# EAGLE schematic schema no connections (EAGLE 7.2.0)
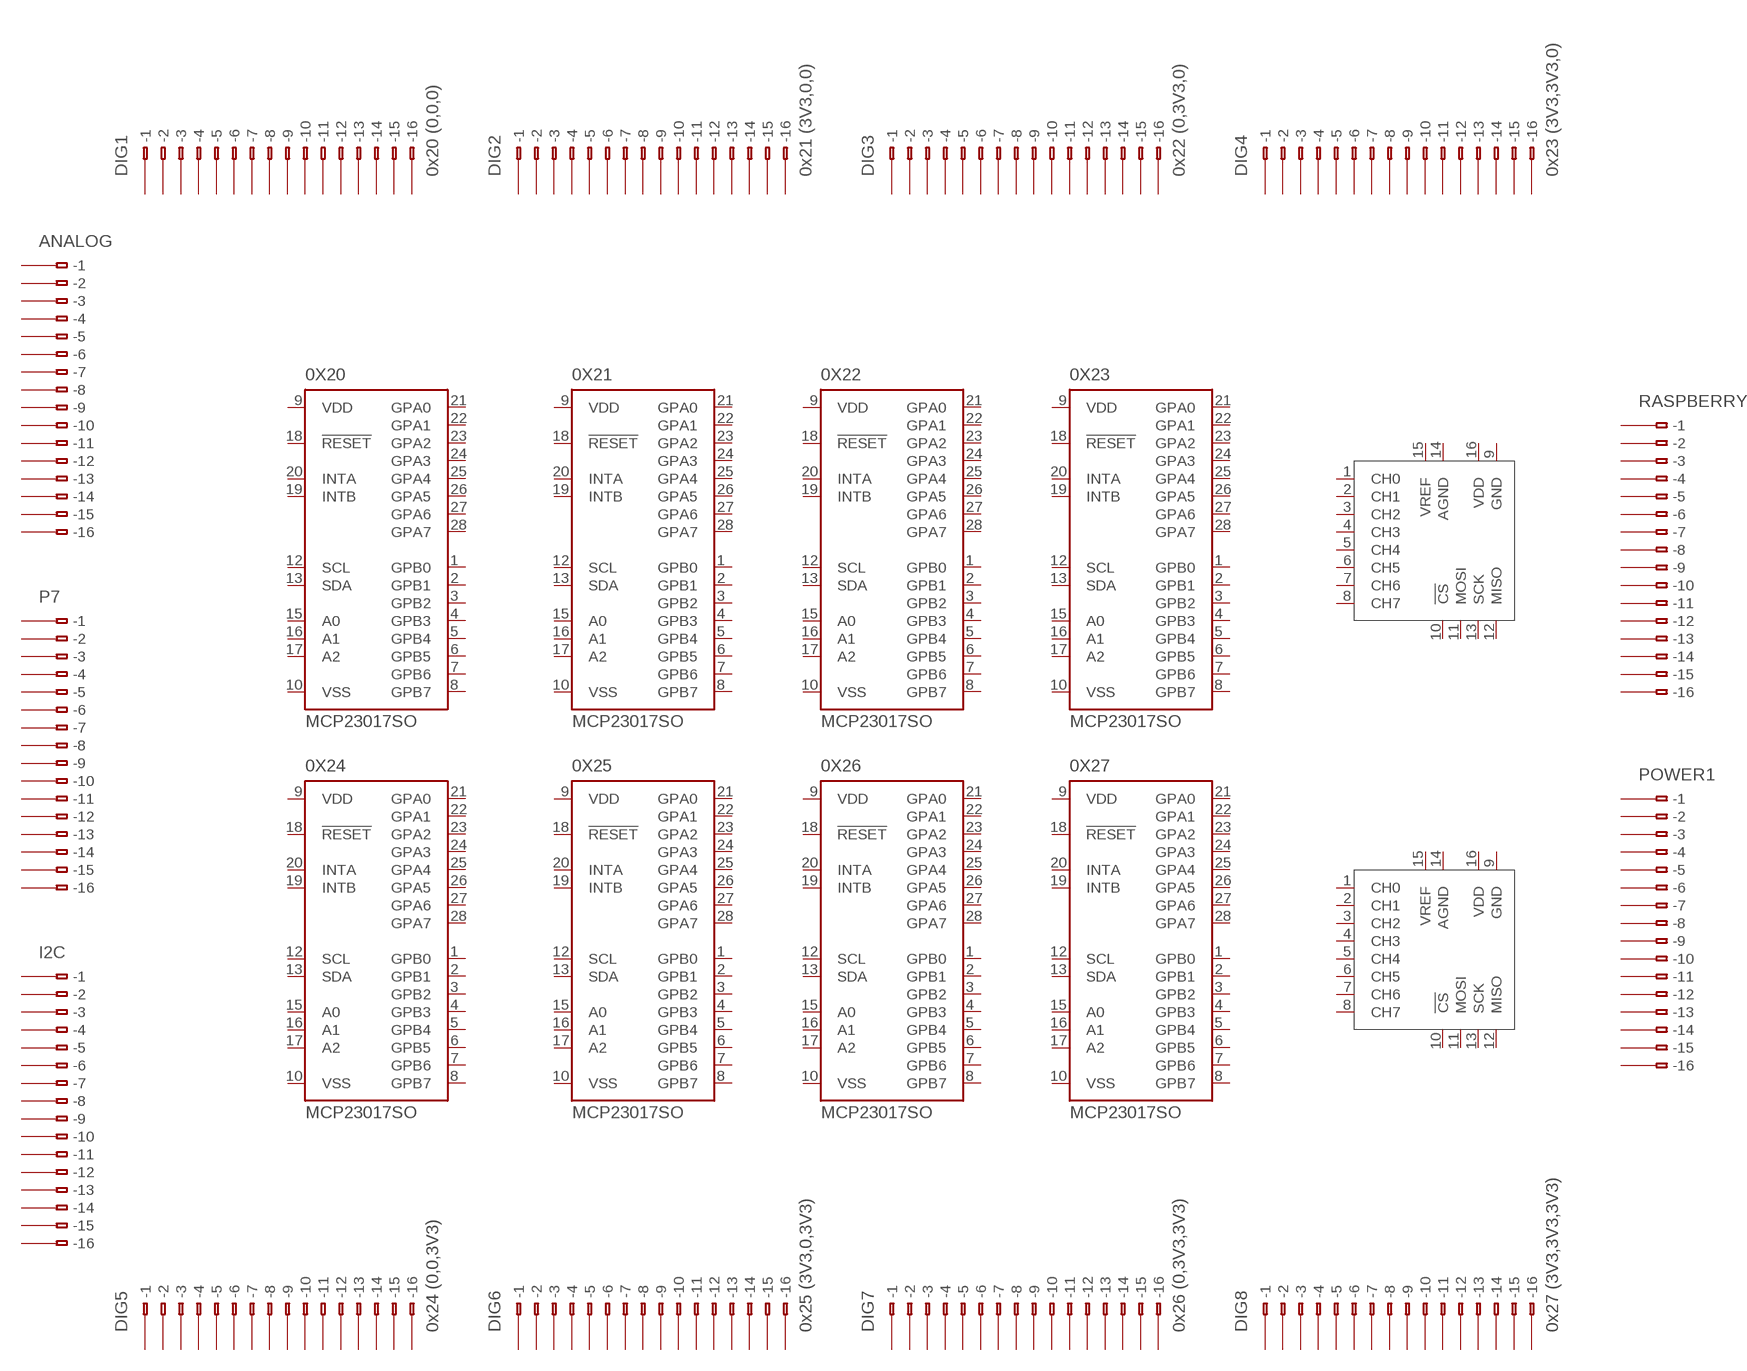
[diagram p0: schematic, sheet 1]

## Parts
0X20  MCP23017SO  [SO28W]
0X21  MCP23017SO  [SO28W]
0X22  MCP23017SO  [SO28W]
0X23  MCP23017SO  [SO28W]
0X24  MCP23017SO  [SO28W]
0X25  MCP23017SO  [SO28W]
0X26  MCP23017SO  [SO28W]
0X27  MCP23017SO  [SO28W]
ANALOG  233-116  [233-116]
DIG1  0x20 (0,0,0)  233-116  [233-116]
DIG2  0x21 (3V3,0,0)  233-116  [233-116]
DIG3  0x22 (0,3V3,0)  233-116  [233-116]
DIG4  0x23 (3V3,3V3,0)  233-116  [233-116]
DIG5  0x24 (0,0,3V3)  233-116  [233-116]
DIG6  0x25 (3V3,0,3V3)  233-116  [233-116]
DIG7  0x26 (0,3V3,3V3)  233-116  [233-116]
DIG8  0x27 (3V3,3V3,3V3)  233-116  [233-116]
I2C  233-116  [233-116]
MCP3008-CS0  CS0  MCP3008P  [DIL16]
MCP3008-CS1  CS1  MCP3008P  [DIL16]
P7  233-116  [233-116]
POWER1  233-116  [233-116]
RASPBERRY  233-116  [233-116]
Unconnected: 0X20.1(GPB0) 0X20.2(GPB1) 0X20.3(GPB2) 0X20.4(GPB3) 0X20.5(GPB4) 0X20.6(GPB5) 0X20.7(GPB6) 0X20.8(GPB7) 0X20.12(SCL) 0X20.13(SDA) 0X20.15(A0) 0X20.16(A1) 0X20.17(A2) 0X20.18(!RESET) 0X20.19(INTB) 0X20.20(INTA) 0X20.21(GPA0) 0X20.22(GPA1) 0X20.23(GPA2) 0X20.24(GPA3) 0X20.25(GPA4) 0X20.26(GPA5) 0X20.27(GPA6) 0X20.28(GPA7) 0X21.1(GPB0) 0X21.2(GPB1) 0X21.3(GPB2) 0X21.4(GPB3) 0X21.5(GPB4) 0X21.6(GPB5) 0X21.7(GPB6) 0X21.8(GPB7) 0X21.12(SCL) 0X21.13(SDA) 0X21.15(A0) 0X21.16(A1) 0X21.17(A2) 0X21.18(!RESET) 0X21.19(INTB) 0X21.20(INTA) 0X21.21(GPA0) 0X21.22(GPA1) 0X21.23(GPA2) 0X21.24(GPA3) 0X21.25(GPA4) 0X21.26(GPA5) 0X21.27(GPA6) 0X21.28(GPA7) 0X22.1(GPB0) 0X22.2(GPB1) 0X22.3(GPB2) 0X22.4(GPB3) 0X22.5(GPB4) 0X22.6(GPB5) 0X22.7(GPB6) 0X22.8(GPB7) 0X22.12(SCL) 0X22.13(SDA) 0X22.15(A0) 0X22.16(A1) 0X22.17(A2) 0X22.18(!RESET) 0X22.19(INTB) 0X22.20(INTA) 0X22.21(GPA0) 0X22.22(GPA1) 0X22.23(GPA2) 0X22.24(GPA3) 0X22.25(GPA4) 0X22.26(GPA5) 0X22.27(GPA6) 0X22.28(GPA7) 0X23.1(GPB0) 0X23.2(GPB1) 0X23.3(GPB2) 0X23.4(GPB3) 0X23.5(GPB4) 0X23.6(GPB5) 0X23.7(GPB6) 0X23.8(GPB7) 0X23.12(SCL) 0X23.13(SDA) 0X23.15(A0) 0X23.16(A1) 0X23.17(A2) 0X23.18(!RESET) 0X23.19(INTB) 0X23.20(INTA) 0X23.21(GPA0) 0X23.22(GPA1) 0X23.23(GPA2) 0X23.24(GPA3) 0X23.25(GPA4) 0X23.26(GPA5) 0X23.27(GPA6) 0X23.28(GPA7) 0X24.1(GPB0) 0X24.2(GPB1) 0X24.3(GPB2) 0X24.4(GPB3) 0X24.5(GPB4) 0X24.6(GPB5) 0X24.7(GPB6) 0X24.8(GPB7) 0X24.12(SCL) 0X24.13(SDA) 0X24.15(A0) 0X24.16(A1) 0X24.17(A2) 0X24.18(!RESET) 0X24.19(INTB) 0X24.20(INTA) 0X24.21(GPA0) 0X24.22(GPA1) 0X24.23(GPA2) 0X24.24(GPA3) 0X24.25(GPA4) 0X24.26(GPA5) 0X24.27(GPA6) 0X24.28(GPA7) 0X25.1(GPB0) 0X25.2(GPB1) 0X25.3(GPB2) 0X25.4(GPB3) 0X25.5(GPB4) 0X25.6(GPB5) 0X25.7(GPB6) 0X25.8(GPB7) 0X25.12(SCL) 0X25.13(SDA) 0X25.15(A0) 0X25.16(A1) 0X25.17(A2) 0X25.18(!RESET) 0X25.19(INTB) 0X25.20(INTA) 0X25.21(GPA0) 0X25.22(GPA1) 0X25.23(GPA2) 0X25.24(GPA3) 0X25.25(GPA4) 0X25.26(GPA5) 0X25.27(GPA6) 0X25.28(GPA7) 0X26.1(GPB0) 0X26.2(GPB1) 0X26.3(GPB2) 0X26.4(GPB3) 0X26.5(GPB4) 0X26.6(GPB5) 0X26.7(GPB6) 0X26.8(GPB7) 0X26.12(SCL) 0X26.13(SDA) 0X26.15(A0) 0X26.16(A1) 0X26.17(A2) 0X26.18(!RESET) 0X26.19(INTB) 0X26.20(INTA) 0X26.21(GPA0) 0X26.22(GPA1) 0X26.23(GPA2) 0X26.24(GPA3) 0X26.25(GPA4) 0X26.26(GPA5) 0X26.27(GPA6) 0X26.28(GPA7) 0X27.1(GPB0) 0X27.2(GPB1) 0X27.3(GPB2) 0X27.4(GPB3) 0X27.5(GPB4) 0X27.6(GPB5) 0X27.7(GPB6) 0X27.8(GPB7) 0X27.12(SCL) 0X27.13(SDA) 0X27.15(A0) 0X27.16(A1) 0X27.17(A2) 0X27.18(!RESET) 0X27.19(INTB) 0X27.20(INTA) 0X27.21(GPA0) 0X27.22(GPA1) 0X27.23(GPA2) 0X27.24(GPA3) 0X27.25(GPA4) 0X27.26(GPA5) 0X27.27(GPA6) 0X27.28(GPA7) ANALOG.A1(-1) ANALOG.A2(-2) ANALOG.A3(-3) ANALOG.A4(-4) ANALOG.A5(-5) ANALOG.A6(-6) ANALOG.A7(-7) ANALOG.A8(-8) ANALOG.A9(-9) ANALOG.A10(-10) ANALOG.A11(-11) ANALOG.A12(-12) ANALOG.A13(-13) ANALOG.A14(-14) ANALOG.A15(-15) ANALOG.A16(-16) ANALOG.B1(B-1) ANALOG.B2(B-2) ANALOG.B3(B-3) ANALOG.B4(B-4) ANALOG.B5(B-5) ANALOG.B6(B-6) ANALOG.B7(B-7) ANALOG.B8(B-8) ANALOG.B9(B-9) ANALOG.B10(B-10) ANALOG.B11(B-11) ANALOG.B12(B-12) ANALOG.B13(B-13) ANALOG.B14(B-14) ANALOG.B15(B-15) ANALOG.B16(B-16) DIG1.A1(-1) DIG1.A2(-2) DIG1.A3(-3) DIG1.A4(-4) DIG1.A5(-5) DIG1.A6(-6) DIG1.A7(-7) DIG1.A8(-8) DIG1.A9(-9) DIG1.A10(-10) DIG1.A11(-11) DIG1.A12(-12) DIG1.A13(-13) DIG1.A14(-14) DIG1.A15(-15) DIG1.A16(-16) DIG1.B1(B-1) DIG1.B2(B-2) DIG1.B3(B-3) DIG1.B4(B-4) DIG1.B5(B-5) DIG1.B6(B-6) DIG1.B7(B-7) DIG1.B8(B-8) DIG1.B9(B-9) DIG1.B10(B-10) DIG1.B11(B-11) DIG1.B12(B-12) DIG1.B13(B-13) DIG1.B14(B-14) DIG1.B15(B-15) DIG1.B16(B-16) DIG2.A1(-1) DIG2.A2(-2) DIG2.A3(-3) DIG2.A4(-4) DIG2.A5(-5) DIG2.A6(-6) DIG2.A7(-7) DIG2.A8(-8) DIG2.A9(-9) DIG2.A10(-10) DIG2.A11(-11) DIG2.A12(-12) DIG2.A13(-13) DIG2.A14(-14) DIG2.A15(-15) DIG2.A16(-16) DIG2.B1(B-1) DIG2.B2(B-2) DIG2.B3(B-3) DIG2.B4(B-4) DIG2.B5(B-5) DIG2.B6(B-6) DIG2.B7(B-7) DIG2.B8(B-8) DIG2.B9(B-9) DIG2.B10(B-10) DIG2.B11(B-11) DIG2.B12(B-12) DIG2.B13(B-13) DIG2.B14(B-14) DIG2.B15(B-15) DIG2.B16(B-16) DIG3.A1(-1) DIG3.A2(-2) DIG3.A3(-3) DIG3.A4(-4) DIG3.A5(-5) DIG3.A6(-6) DIG3.A7(-7) DIG3.A8(-8) DIG3.A9(-9) DIG3.A10(-10) DIG3.A11(-11) DIG3.A12(-12) DIG3.A13(-13) DIG3.A14(-14) DIG3.A15(-15) DIG3.A16(-16) DIG3.B1(B-1) DIG3.B2(B-2) DIG3.B3(B-3) DIG3.B4(B-4) DIG3.B5(B-5) DIG3.B6(B-6) DIG3.B7(B-7) DIG3.B8(B-8) DIG3.B9(B-9) DIG3.B10(B-10) DIG3.B11(B-11) DIG3.B12(B-12) DIG3.B13(B-13) DIG3.B14(B-14) DIG3.B15(B-15) DIG3.B16(B-16) DIG4.A1(-1) DIG4.A2(-2) DIG4.A3(-3) DIG4.A4(-4) DIG4.A5(-5) DIG4.A6(-6) DIG4.A7(-7) DIG4.A8(-8) DIG4.A9(-9) DIG4.A10(-10) DIG4.A11(-11) DIG4.A12(-12) DIG4.A13(-13) DIG4.A14(-14) DIG4.A15(-15) DIG4.A16(-16) DIG4.B1(B-1) DIG4.B2(B-2) DIG4.B3(B-3) DIG4.B4(B-4) DIG4.B5(B-5) DIG4.B6(B-6) DIG4.B7(B-7) DIG4.B8(B-8) DIG4.B9(B-9) DIG4.B10(B-10) DIG4.B11(B-11) DIG4.B12(B-12) DIG4.B13(B-13) DIG4.B14(B-14) DIG4.B15(B-15) DIG4.B16(B-16) DIG5.A1(-1) DIG5.A2(-2) DIG5.A3(-3) DIG5.A4(-4) DIG5.A5(-5) DIG5.A6(-6) DIG5.A7(-7) DIG5.A8(-8) DIG5.A9(-9) DIG5.A10(-10) DIG5.A11(-11) DIG5.A12(-12) DIG5.A13(-13) DIG5.A14(-14) DIG5.A15(-15) DIG5.A16(-16) DIG5.B1(B-1) DIG5.B2(B-2) DIG5.B3(B-3) DIG5.B4(B-4) DIG5.B5(B-5) DIG5.B6(B-6) DIG5.B7(B-7) DIG5.B8(B-8) DIG5.B9(B-9) DIG5.B10(B-10) DIG5.B11(B-11) DIG5.B12(B-12) DIG5.B13(B-13) DIG5.B14(B-14) DIG5.B15(B-15) DIG5.B16(B-16) DIG6.A1(-1) DIG6.A2(-2) DIG6.A3(-3) DIG6.A4(-4) DIG6.A5(-5) DIG6.A6(-6) DIG6.A7(-7) DIG6.A8(-8) DIG6.A9(-9) DIG6.A10(-10) DIG6.A11(-11) DIG6.A12(-12) DIG6.A13(-13) DIG6.A14(-14) DIG6.A15(-15) DIG6.A16(-16) DIG6.B1(B-1) DIG6.B2(B-2) DIG6.B3(B-3) DIG6.B4(B-4) DIG6.B5(B-5) DIG6.B6(B-6) DIG6.B7(B-7) DIG6.B8(B-8) DIG6.B9(B-9) DIG6.B10(B-10) DIG6.B11(B-11) DIG6.B12(B-12) DIG6.B13(B-13) DIG6.B14(B-14) DIG6.B15(B-15) DIG6.B16(B-16) DIG7.A1(-1) DIG7.A2(-2) DIG7.A3(-3) DIG7.A4(-4) DIG7.A5(-5) DIG7.A6(-6) DIG7.A7(-7) DIG7.A8(-8) DIG7.A9(-9) DIG7.A10(-10) DIG7.A11(-11) DIG7.A12(-12) DIG7.A13(-13) DIG7.A14(-14) DIG7.A15(-15) DIG7.A16(-16) DIG7.B1(B-1) DIG7.B2(B-2) DIG7.B3(B-3) DIG7.B4(B-4) DIG7.B5(B-5) DIG7.B6(B-6) DIG7.B7(B-7) DIG7.B8(B-8) DIG7.B9(B-9) DIG7.B10(B-10) DIG7.B11(B-11) DIG7.B12(B-12) DIG7.B13(B-13) DIG7.B14(B-14) DIG7.B15(B-15) DIG7.B16(B-16) DIG8.A1(-1) DIG8.A2(-2) DIG8.A3(-3) DIG8.A4(-4) DIG8.A5(-5) DIG8.A6(-6) DIG8.A7(-7) DIG8.A8(-8) DIG8.A9(-9) DIG8.A10(-10) DIG8.A11(-11) DIG8.A12(-12) DIG8.A13(-13) DIG8.A14(-14) DIG8.A15(-15) DIG8.A16(-16) DIG8.B1(B-1) DIG8.B2(B-2) DIG8.B3(B-3) DIG8.B4(B-4) DIG8.B5(B-5) DIG8.B6(B-6) DIG8.B7(B-7) DIG8.B8(B-8) DIG8.B9(B-9) DIG8.B10(B-10) DIG8.B11(B-11) DIG8.B12(B-12) DIG8.B13(B-13) DIG8.B14(B-14) DIG8.B15(B-15) DIG8.B16(B-16) I2C.A1(-1) I2C.A2(-2) I2C.A3(-3) I2C.A4(-4) I2C.A5(-5) I2C.A6(-6) I2C.A7(-7) I2C.A8(-8) I2C.A9(-9) I2C.A10(-10) I2C.A11(-11) I2C.A12(-12) I2C.A13(-13) I2C.A14(-14) I2C.A15(-15) I2C.A16(-16) I2C.B1(B-1) I2C.B2(B-2) I2C.B3(B-3) I2C.B4(B-4) I2C.B5(B-5) I2C.B6(B-6) I2C.B7(B-7) I2C.B8(B-8) I2C.B9(B-9) I2C.B10(B-10) I2C.B11(B-11) I2C.B12(B-12) I2C.B13(B-13) I2C.B14(B-14) I2C.B15(B-15) I2C.B16(B-16) MCP3008-CS0.1(CH0) MCP3008-CS0.2(CH1) MCP3008-CS0.3(CH2) MCP3008-CS0.4(CH3) MCP3008-CS0.5(CH4) MCP3008-CS0.6(CH5) MCP3008-CS0.7(CH6) MCP3008-CS0.8(CH7) MCP3008-CS0.10(!CS) MCP3008-CS0.11(MOSI) MCP3008-CS0.12(MISO) MCP3008-CS0.13(SCK) MCP3008-CS1.1(CH0) MCP3008-CS1.2(CH1) MCP3008-CS1.3(CH2) MCP3008-CS1.4(CH3) MCP3008-CS1.5(CH4) MCP3008-CS1.6(CH5) MCP3008-CS1.7(CH6) MCP3008-CS1.8(CH7) MCP3008-CS1.10(!CS) MCP3008-CS1.11(MOSI) MCP3008-CS1.12(MISO) MCP3008-CS1.13(SCK) P7.A1(-1) P7.A2(-2) P7.A3(-3) P7.A4(-4) P7.A5(-5) P7.A6(-6) P7.A7(-7) P7.A8(-8) P7.A9(-9) P7.A10(-10) P7.A11(-11) P7.A12(-12) P7.A13(-13) P7.A14(-14) P7.A15(-15) P7.A16(-16) P7.B1(B-1) P7.B2(B-2) P7.B3(B-3) P7.B4(B-4) P7.B5(B-5) P7.B6(B-6) P7.B7(B-7) P7.B8(B-8) P7.B9(B-9) P7.B10(B-10) P7.B11(B-11) P7.B12(B-12) P7.B13(B-13) P7.B14(B-14) P7.B15(B-15) P7.B16(B-16) POWER1.A1(-1) POWER1.A2(-2) POWER1.A3(-3) POWER1.A4(-4) POWER1.A5(-5) POWER1.A6(-6) POWER1.A7(-7) POWER1.A8(-8) POWER1.A9(-9) POWER1.A10(-10) POWER1.A11(-11) POWER1.A12(-12) POWER1.A13(-13) POWER1.A14(-14) POWER1.A15(-15) POWER1.A16(-16) POWER1.B1(B-1) POWER1.B2(B-2) POWER1.B3(B-3) POWER1.B4(B-4) POWER1.B5(B-5) POWER1.B6(B-6) POWER1.B7(B-7) POWER1.B8(B-8) POWER1.B9(B-9) POWER1.B10(B-10) POWER1.B11(B-11) POWER1.B12(B-12) POWER1.B13(B-13) POWER1.B14(B-14) POWER1.B15(B-15) POWER1.B16(B-16) RASPBERRY.A1(-1) RASPBERRY.A2(-2) RASPBERRY.A3(-3) RASPBERRY.A4(-4) RASPBERRY.A5(-5) RASPBERRY.A6(-6) RASPBERRY.A7(-7) RASPBERRY.A8(-8) RASPBERRY.A9(-9) RASPBERRY.A10(-10) RASPBERRY.A11(-11) RASPBERRY.A12(-12) RASPBERRY.A13(-13) RASPBERRY.A14(-14) RASPBERRY.A15(-15) RASPBERRY.A16(-16) RASPBERRY.B1(B-1) RASPBERRY.B2(B-2) RASPBERRY.B3(B-3) RASPBERRY.B4(B-4) RASPBERRY.B5(B-5) RASPBERRY.B6(B-6) RASPBERRY.B7(B-7) RASPBERRY.B8(B-8) RASPBERRY.B9(B-9) RASPBERRY.B10(B-10) RASPBERRY.B11(B-11) RASPBERRY.B12(B-12) RASPBERRY.B13(B-13) RASPBERRY.B14(B-14) RASPBERRY.B15(B-15) RASPBERRY.B16(B-16)

## Power pins joined to a net without a drawn wire
AGND: MCP3008-CS0.14(AGND) MCP3008-CS1.14(AGND)
GND: MCP3008-CS0.9(GND) MCP3008-CS1.9(GND)
VDD: 0X20.9(VDD) 0X21.9(VDD) 0X22.9(VDD) 0X23.9(VDD) 0X24.9(VDD) 0X25.9(VDD) 0X26.9(VDD) 0X27.9(VDD) MCP3008-CS0.16(VDD) MCP3008-CS1.16(VDD)
VREF: MCP3008-CS0.15(VREF) MCP3008-CS1.15(VREF)
VSS: 0X20.10(VSS) 0X21.10(VSS) 0X22.10(VSS) 0X23.10(VSS) 0X24.10(VSS) 0X25.10(VSS) 0X26.10(VSS) 0X27.10(VSS)

## Library data of the parts
0X20-0X27 = microchip:MCP23017: http://ww1.microchip.com/downloads/en/DeviceDoc/21952a.pdf Source: http://ww1.microchip.com/downloads/en/DeviceDoc/21952a.pdf; MF: MICROCHIP; MPN: MCP23017-E/SO; OC_FARNELL: 1332087; OC_NEWARK: 31K2958
ANALOG DIG1-DIG8 I2C P7 POWER1 RASPBERRY = con-wago:233-116: WAGO Cage Clamp; MPN: 233-116; OC_FARNELL: unknown; OC_NEWARK: 28K9054
MCP3008-CS0 MCP3008-CS1 = MCP3008:MCP3008